# EAGLE schematic WS (EAGLE 9.5.2)
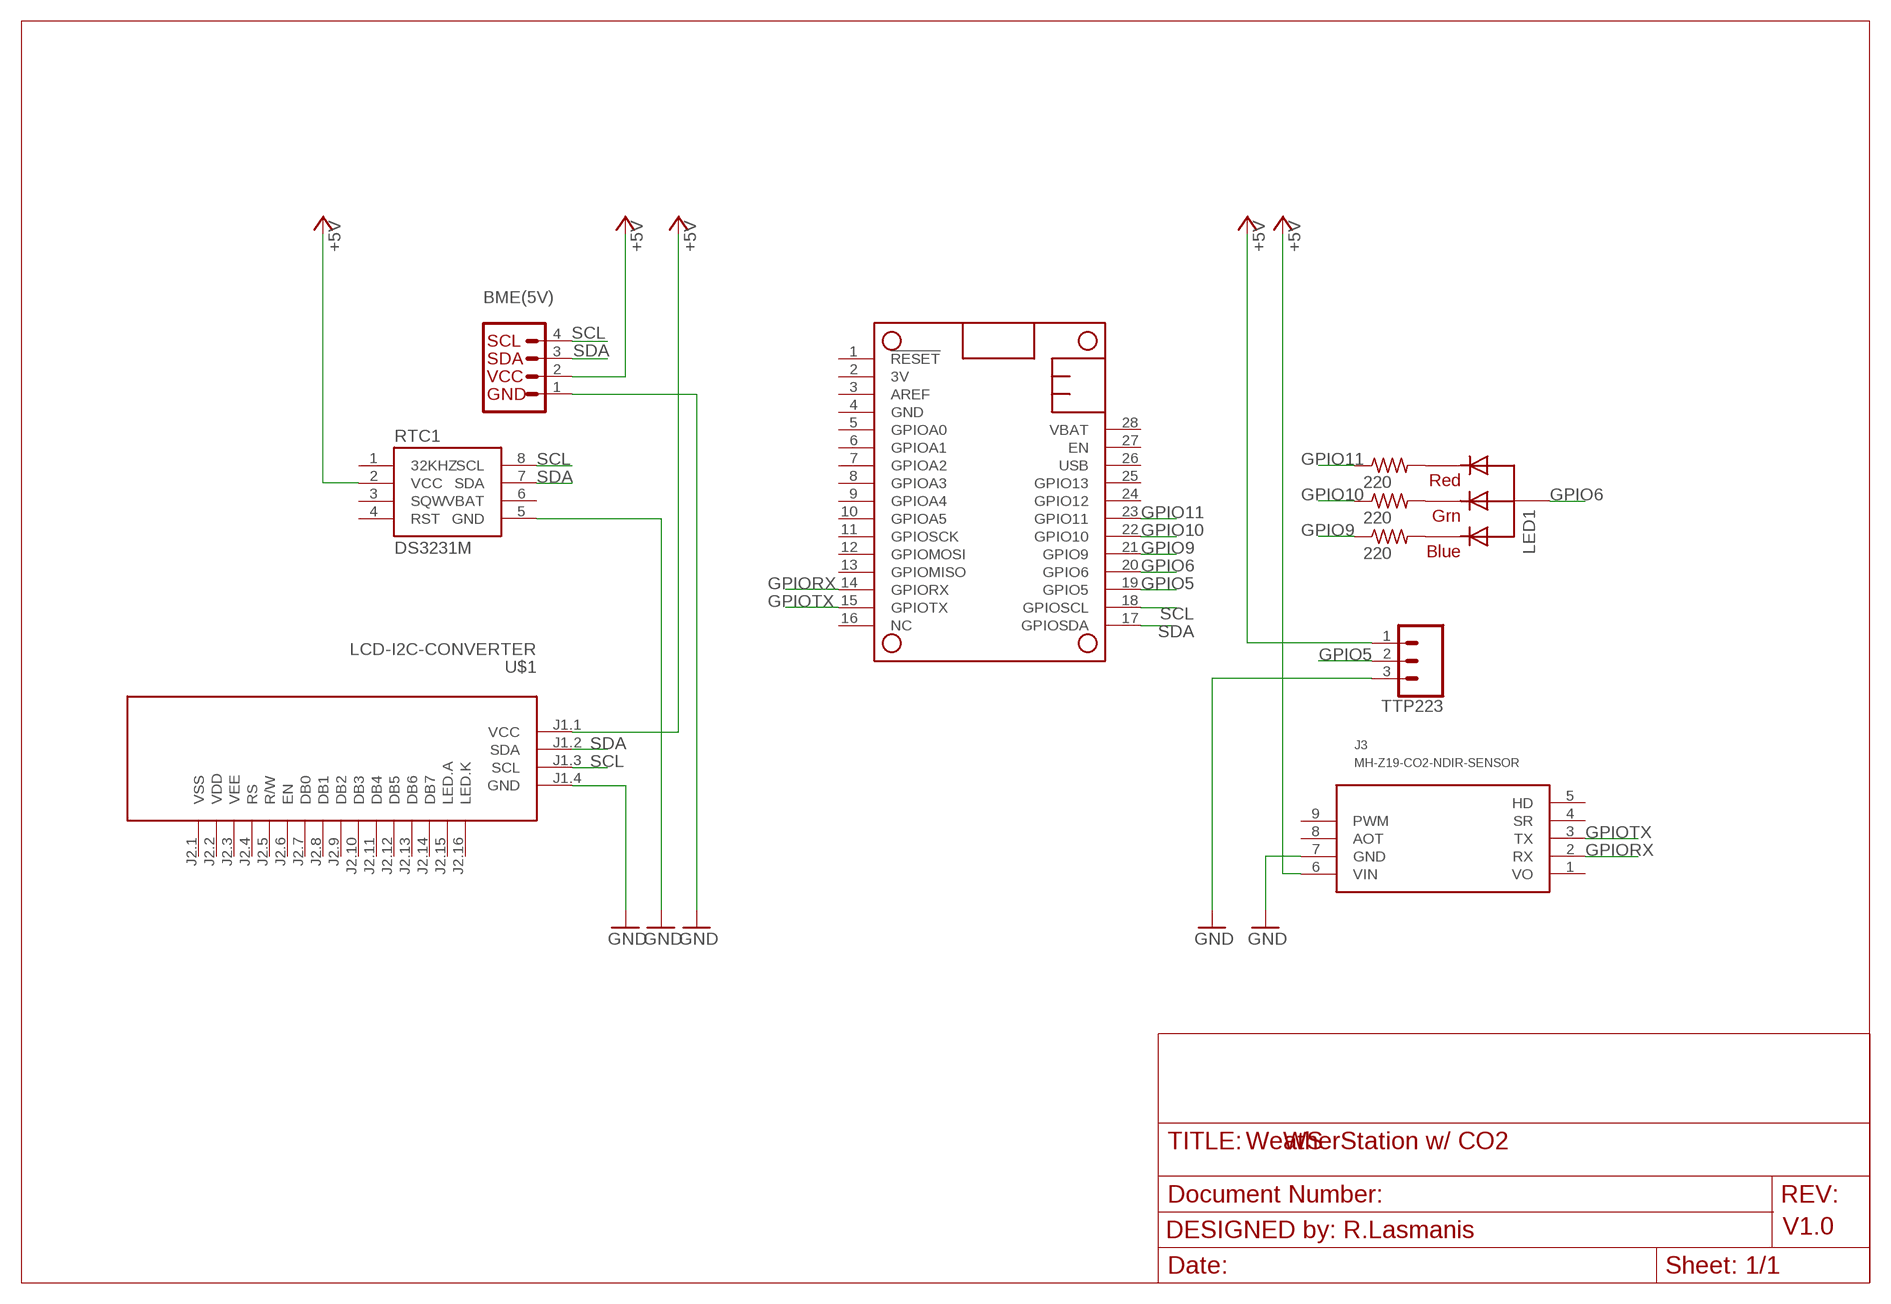
[diagram p0: schematic, sheet 1]

## Parts
BME(5V)  I2C_STANDARD  [1X04]
J3  MH-Z19-CO2-NDIR-SENSOR  [MH-Z19]
LED1  RGBLED_CA-5MM  [LED5MMRGB]
MS1  FEATHERWING  [FEATHERWING]
R2  220  R-US_0309/V  [0309V]
R3  220  R-US_0309/V  [0309V]
R4  220  R-US_0309/V  [0309V]
RTC1  DS3231M  [SO08]
TTP223  CONN_03JST-PTH-NS  [JST-3-PTH-NS]
U$1  LCD-I2C-CONVERTER  [LCD-I2C-CONVERTER]

## Nets
+5V: BME(5V).2 J3.6(VIN) RTC1.2(VCC) TTP223.1 U$1.J1.1(VCC)
GND: BME(5V).1 J3.7(GND) RTC1.5(GND) TTP223.3 U$1.J1.4(GND)
GPIO5: MS1.19(GPIO5) TTP223.2
GPIO6: LED1.2(VCC) MS1.20(GPIO6)
GPIO9: MS1.21(GPIO9) R2.1
GPIO10: MS1.22(GPIO10) R3.1
GPIO11: MS1.23(GPIO11) R4.1
GPIORX: J3.2(RX) MS1.14(GPIORX)
GPIOTX: J3.3(TX) MS1.15(GPIOTX)
N$2: LED1.4(BLUE) R2.2
N$3: LED1.3(GREEN) R3.2
N$4: LED1.1(RED) R4.2
SCL: BME(5V).4 MS1.18(GPIOSCL) RTC1.8(SCL) U$1.J1.3(SCL)
SDA: BME(5V).3 MS1.17(GPIOSDA) RTC1.7(SDA) U$1.J1.2(SDA)
Unconnected: J3.4(SR) J3.5(HD) J3.8(AOT) J3.9(PWM) MS1.1(!RESET) MS1.2(3V) MS1.3(AREF) MS1.5(GPIOA0) MS1.6(GPIOA1) MS1.7(GPIOA2) MS1.8(GPIOA3) MS1.9(GPIOA4) MS1.10(GPIOA5) MS1.11(GPIOSCK) MS1.12(GPIOMOSI) MS1.13(GPIOMISO) MS1.16(NC) MS1.24(GPIO12) MS1.25(GPIO13) MS1.26(USB) MS1.27(EN) MS1.28(VBAT) RTC1.1(32KHZ) RTC1.3(SQW) RTC1.4(RST) U$1.J2.1(VSS) U$1.J2.2(VDD) U$1.J2.3(VEE) U$1.J2.4(RS) U$1.J2.5(R/W) U$1.J2.6(EN) U$1.J2.7(DB0) U$1.J2.8(DB1) U$1.J2.9(DB2) U$1.J2.10(DB3) U$1.J2.11(DB4) U$1.J2.12(DB5) U$1.J2.13(DB6) U$1.J2.14(DB7) U$1.J2.15(LED.A) U$1.J2.16(LED.K)

## Notes on the sheet
- WeatherStation w/ CO2
- DESIGNED by: R.Lasmanis | V1.0

## Power pins joined to a net without a drawn wire
GND: MS1.4(GND)
VBAT: RTC1.6(VBAT)
VO: J3.1(VO)

## Library data of the parts
BME(5V) = SparkFun-Connectors:I2C_STANDARD: SparkFun I2C Standard Pinout Header SparkFun has standardized on a pinout for all I2C based sensor breakouts. This pinout allows I2C boards to be plugged directly into the headers on Arduino Uno compatible boards, and to be daisy chained easily. Example SparkFun Products: SparkFun Atmospheric Sensor Breakout - BME280 <https://www.sparkfun.com/products/13676> SparkFun Altitude/Pressure Sensor Breakout - MPL3115A2 <https://www.sparkfun.com/products/11084> SparkFun TOF Range Finder Sensor - VL6180 <https://www.sparkfun.com/products/12785>
J3 = mh-z19:MH-Z19: MH-Z19 - CO2 NDIR SENSOR
LED1 = adafruit:RGBLED_CA: RGB LED, common-anode 5MM Staggered pins 5mm Piranha package http://www.ladyada.net/library/pcb/eaglelibrary.html
MS1 = adafruit:FEATHERWING
R2-R4 = adafruit:R-US_: RESISTOR, American symbol
RTC1 = SparkFun-Clocks:DS3231M: DS3231M Real Time Clock Accuracy +/-5ppm. Battery Backup. 2.3V to 5.5V. Datasheet <https://cdn.sparkfun.com/datasheets/Dev/Beagle/DS3231M.pdf> SparkFun Products CryptoCape <https://www.sparkfun.com/products/12773> (DEV-12773) SparkFun CryptoShield <https://www.sparkfun.com/products/13183> (DEV-13183); PROD_ID: IC-11985
TTP223 = SparkFun-Connectors:CONN_03: Multi connection point. Often used as Generic Header-pin footprint for 0.1 inch spaced/style header connections On any of the 0.1 inch spaced packages, you can populate with these: Break Away Headers - Straight <https://www.sparkfun.com/products/116> (PRT-00116) Break Away Male Headers - Right Angle <https://www.sparkfun.com/products/553> (PRT-00553) Female Headers <https://www.sparkfun.com/products/115> (PRT-00115) Break Away Headers - Machine Pin <https://www.sparkfun.com/products/117> (PRT-00117) Break Away Female Headers - Swiss Machine Pin <https://www.sparkfun.com/products/743> (PRT-00743) Stackable Header - 3 Pin (Female, 0.1") <https://www.sparkfun.com/products/13875> (PRT-13875) For SCREWTERMINALS and SPRING TERMINALS visit here: Screw Terimnals on SparkFun.com <https://www.sparkfun.com/search/results?term=Screw+Terminals> (5mm/3.5mm/2.54mm spacing) This device is also useful as a general connection point to wire up your design to another part of your project. Our various solder wires solder well into these plated through hole pads. Hook-Up Wire - Assortment (Stranded, 22 AWG) <https://www.sparkfun.com/products/11375> (PRT-11375) Hook-Up Wire - Assortment (Solid Core, 22 AWG) <https://www.sparkfun.com/products/11367> (PRT-11367) View the entire wire category on our website here <https://www.sparkfun.com/categories/141> Special notes: Molex polarized connector foot print use with SKU : PRT-08232 with associated crimp pins and housings.
U$1 = diy-modules:LCD-I2C-CONVERTER: I2C Bus to 4-Bit Parallel LCD Interface with LED backlight driver